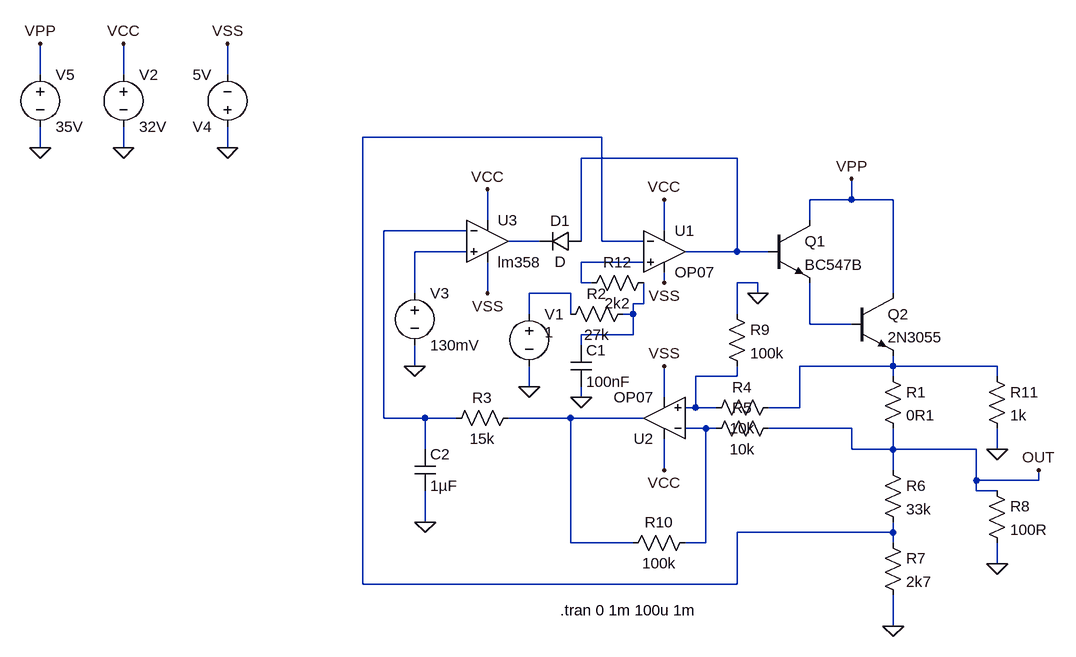
[diagram p0: schematic Supplier_V1_0.asc]
Supplier_V1_0.asc, the LTspice schematic file:
Version 4
SHEET 1 2256 1060
WIRE -752 -176 -752 -224
WIRE -624 -176 -624 -224
WIRE -464 -176 -464 -224
WIRE 112 -80 -256 -80
WIRE -752 -64 -752 -96
WIRE -624 -64 -624 -96
WIRE -464 -64 -464 -96
WIRE 320 -48 80 -48
WIRE 496 16 496 -16
WIRE 496 16 432 16
WIRE 560 16 496 16
WIRE -64 48 -64 0
WIRE 432 48 432 16
WIRE -96 64 -224 64
WIRE 208 64 208 16
WIRE 16 80 -32 80
WIRE 80 80 80 -48
WIRE 112 80 112 -80
WIRE 176 80 112 80
WIRE -96 96 -176 96
WIRE 320 96 320 -48
WIRE 320 96 240 96
WIRE 368 96 320 96
WIRE 176 112 80 112
WIRE 80 144 80 112
WIRE 96 144 80 144
WIRE 208 144 208 128
WIRE 352 144 320 144
WIRE -176 160 -176 96
WIRE -64 160 -64 112
WIRE 64 160 0 160
WIRE 352 160 352 144
WIRE 560 160 560 16
WIRE 176 176 176 144
WIRE 176 176 160 176
WIRE 0 192 0 160
WIRE 64 192 64 160
WIRE 160 192 160 176
WIRE 160 192 144 192
WIRE 320 192 320 144
WIRE 432 208 432 144
WIRE 496 208 432 208
WIRE 160 224 160 192
WIRE 160 224 80 224
WIRE 80 240 80 224
WIRE -176 272 -176 240
WIRE 560 272 560 256
WIRE 560 272 416 272
WIRE 720 272 560 272
WIRE 320 288 320 272
WIRE 320 288 256 288
WIRE 560 288 560 272
WIRE 720 288 720 272
WIRE 0 304 0 272
WIRE 80 320 80 304
WIRE 208 320 208 272
WIRE 256 336 256 288
WIRE 256 336 240 336
WIRE 288 336 256 336
WIRE 416 336 416 272
WIRE 416 336 368 336
WIRE -224 352 -224 64
WIRE -160 352 -224 352
WIRE -112 352 -160 352
WIRE 64 352 -32 352
WIRE 176 352 64 352
WIRE 272 368 240 368
WIRE 288 368 272 368
WIRE 496 368 368 368
WIRE -160 400 -160 352
WIRE 496 400 496 368
WIRE 560 400 560 368
WIRE 560 400 496 400
WIRE 688 400 560 400
WIRE 720 400 720 368
WIRE 208 432 208 384
WIRE 560 432 560 400
WIRE 688 448 688 400
WIRE 784 448 784 432
WIRE 784 448 688 448
WIRE 688 464 688 448
WIRE 720 464 688 464
WIRE -160 512 -160 464
WIRE 560 528 560 512
WIRE 560 528 320 528
WIRE 64 544 64 352
WIRE 160 544 64 544
WIRE 272 544 272 368
WIRE 272 544 240 544
WIRE 560 544 560 528
WIRE 720 576 720 544
WIRE -256 608 -256 -80
WIRE 320 608 320 528
WIRE 320 608 -256 608
WIRE 560 672 560 624
FLAG 0 304 0
FLAG 560 672 0
FLAG -624 -64 0
FLAG -176 272 0
FLAG 720 576 0
FLAG 352 160 0
FLAG 784 432 OUT
FLAG -464 -64 0
FLAG 720 400 0
FLAG -624 -224 VCC
FLAG -464 -224 VSS
FLAG -64 0 VCC
FLAG -64 160 VSS
FLAG 208 272 VSS
FLAG 208 432 VCC
FLAG 208 16 VCC
FLAG 496 -16 VPP
FLAG -752 -224 VPP
FLAG -752 -64 0
FLAG 80 320 0
FLAG 208 144 VSS
FLAG -160 512 0
SYMBOL npn 368 48 R0
SYMATTR InstName Q1
SYMATTR Value BC547B
SYMBOL npn 496 160 R0
SYMATTR InstName Q2
SYMATTR Value 2N3055
SYMBOL res 544 272 R0
SYMATTR InstName R1
SYMATTR Value 0R1
SYMBOL res 48 208 R270
WINDOW 0 32 56 VTop 0
WINDOW 3 0 56 VBottom 0
SYMATTR InstName R2
SYMATTR Value 27k
SYMBOL voltage 0 176 R0
WINDOW 123 0 0 Left 0
WINDOW 39 0 0 Left 0
WINDOW 3 24 44 Left 0
SYMATTR Value 1
SYMATTR InstName V1
SYMBOL res 384 320 R90
WINDOW 0 0 56 VBottom 0
WINDOW 3 32 56 VTop 0
SYMATTR InstName R4
SYMATTR Value 10k
SYMBOL res 384 352 R90
WINDOW 0 0 56 VBottom 0
WINDOW 3 32 56 VTop 0
SYMATTR InstName R5
SYMATTR Value 10k
SYMBOL diode 80 64 R90
WINDOW 0 0 32 VBottom 0
WINDOW 3 32 32 VTop 0
SYMATTR InstName D1
SYMBOL res 544 416 R0
SYMATTR InstName R6
SYMATTR Value 33k
SYMBOL res 544 528 R0
SYMATTR InstName R7
SYMATTR Value 2k7
SYMBOL voltage -624 -192 R0
WINDOW 123 0 0 Left 0
WINDOW 39 0 0 Left 0
SYMATTR InstName V2
SYMATTR Value 32V
SYMBOL voltage -176 144 R0
WINDOW 123 0 0 Left 0
WINDOW 39 0 0 Left 0
SYMATTR InstName V3
SYMATTR Value 130mV
SYMBOL res 704 448 R0
SYMATTR InstName R8
SYMATTR Value 100R
SYMATTR SpiceLine tol=20
SYMBOL res 304 176 R0
SYMATTR InstName R9
SYMATTR Value 100k
SYMBOL res 256 528 R90
WINDOW 0 0 56 VBottom 0
WINDOW 3 32 56 VTop 0
SYMATTR InstName R10
SYMATTR Value 100k
SYMBOL myLib\\op07 208 416 R180
SYMATTR InstName U2
SYMBOL voltage -464 -80 R180
WINDOW 123 0 0 Left 0
WINDOW 39 0 0 Left 0
SYMATTR InstName V4
SYMATTR Value 5V
SYMBOL res 704 272 R0
SYMATTR InstName R11
SYMATTR Value 1k
SYMBOL myLib\\lm358 -64 16 R0
SYMATTR InstName U3
SYMBOL voltage -752 -192 R0
WINDOW 123 0 0 Left 0
WINDOW 39 0 0 Left 0
SYMATTR InstName V5
SYMATTR Value 35V
SYMBOL cap 64 240 R0
SYMATTR InstName C1
SYMATTR Value 100nF
SYMBOL res 192 128 R90
WINDOW 0 0 56 VBottom 0
WINDOW 3 32 56 VTop 0
SYMATTR InstName R12
SYMATTR Value 2k2
SYMBOL myLib\\op07 208 32 R0
SYMATTR InstName U1
SYMBOL res -16 336 R90
WINDOW 0 0 56 VBottom 0
WINDOW 3 32 56 VTop 0
SYMATTR InstName R3
SYMATTR Value 15k
SYMBOL cap -176 400 R0
SYMATTR InstName C2
SYMATTR Value 1µF
TEXT 48 648 Left 0 !.tran 0 1m 100u 1m

The netlist it stands for:
* Supplier_V1_0.asc
Q1 VPP N002 N009 0 BC547B
Q2 VPP N009 N010 0 2N3055
R1 N010 OUT 0R1
R2 N007 N008 27k
V1 N007 0 1
R4 N010 N011 10k
R5 OUT N013 10k
D1 N002 N004 D
R6 OUT N001 33k
R7 N001 0 2k7
V2 VCC 0 32V
V3 N005 0 130mV
R8 OUT 0 100R tol=20
R9 0 N011 100k
R10 N013 N012 100k
XU2 N011 N013 VCC VSS N012 LT1001  ; OP07, pins In+ In- V+ V- OUT
V4 0 VSS 5V
R11 N010 0 1k
* U3: lm358 (symbol myLib\lm358 not available, pins judged from their places): In+=N005 In-=N003 V+=VCC V-=VSS OUT=N004
V5 VPP 0 35V
C1 N008 0 100nF
R12 N008 N006 2k2
XU1 N006 N001 VCC VSS N002 LT1001  ; OP07, pins In+ In- V+ V- OUT
R3 N012 N003 15k
C2 N003 0 1µF
.model D D
.lib standard.dio
.model NPN NPN
.model PNP PNP
.lib standard.bjt
.tran 0 1m 100u 1m
.lib LTC.lib
.backanno
.end